# EAGLE schematic Grove - Light Sensor (EAGLE 7.2.0)
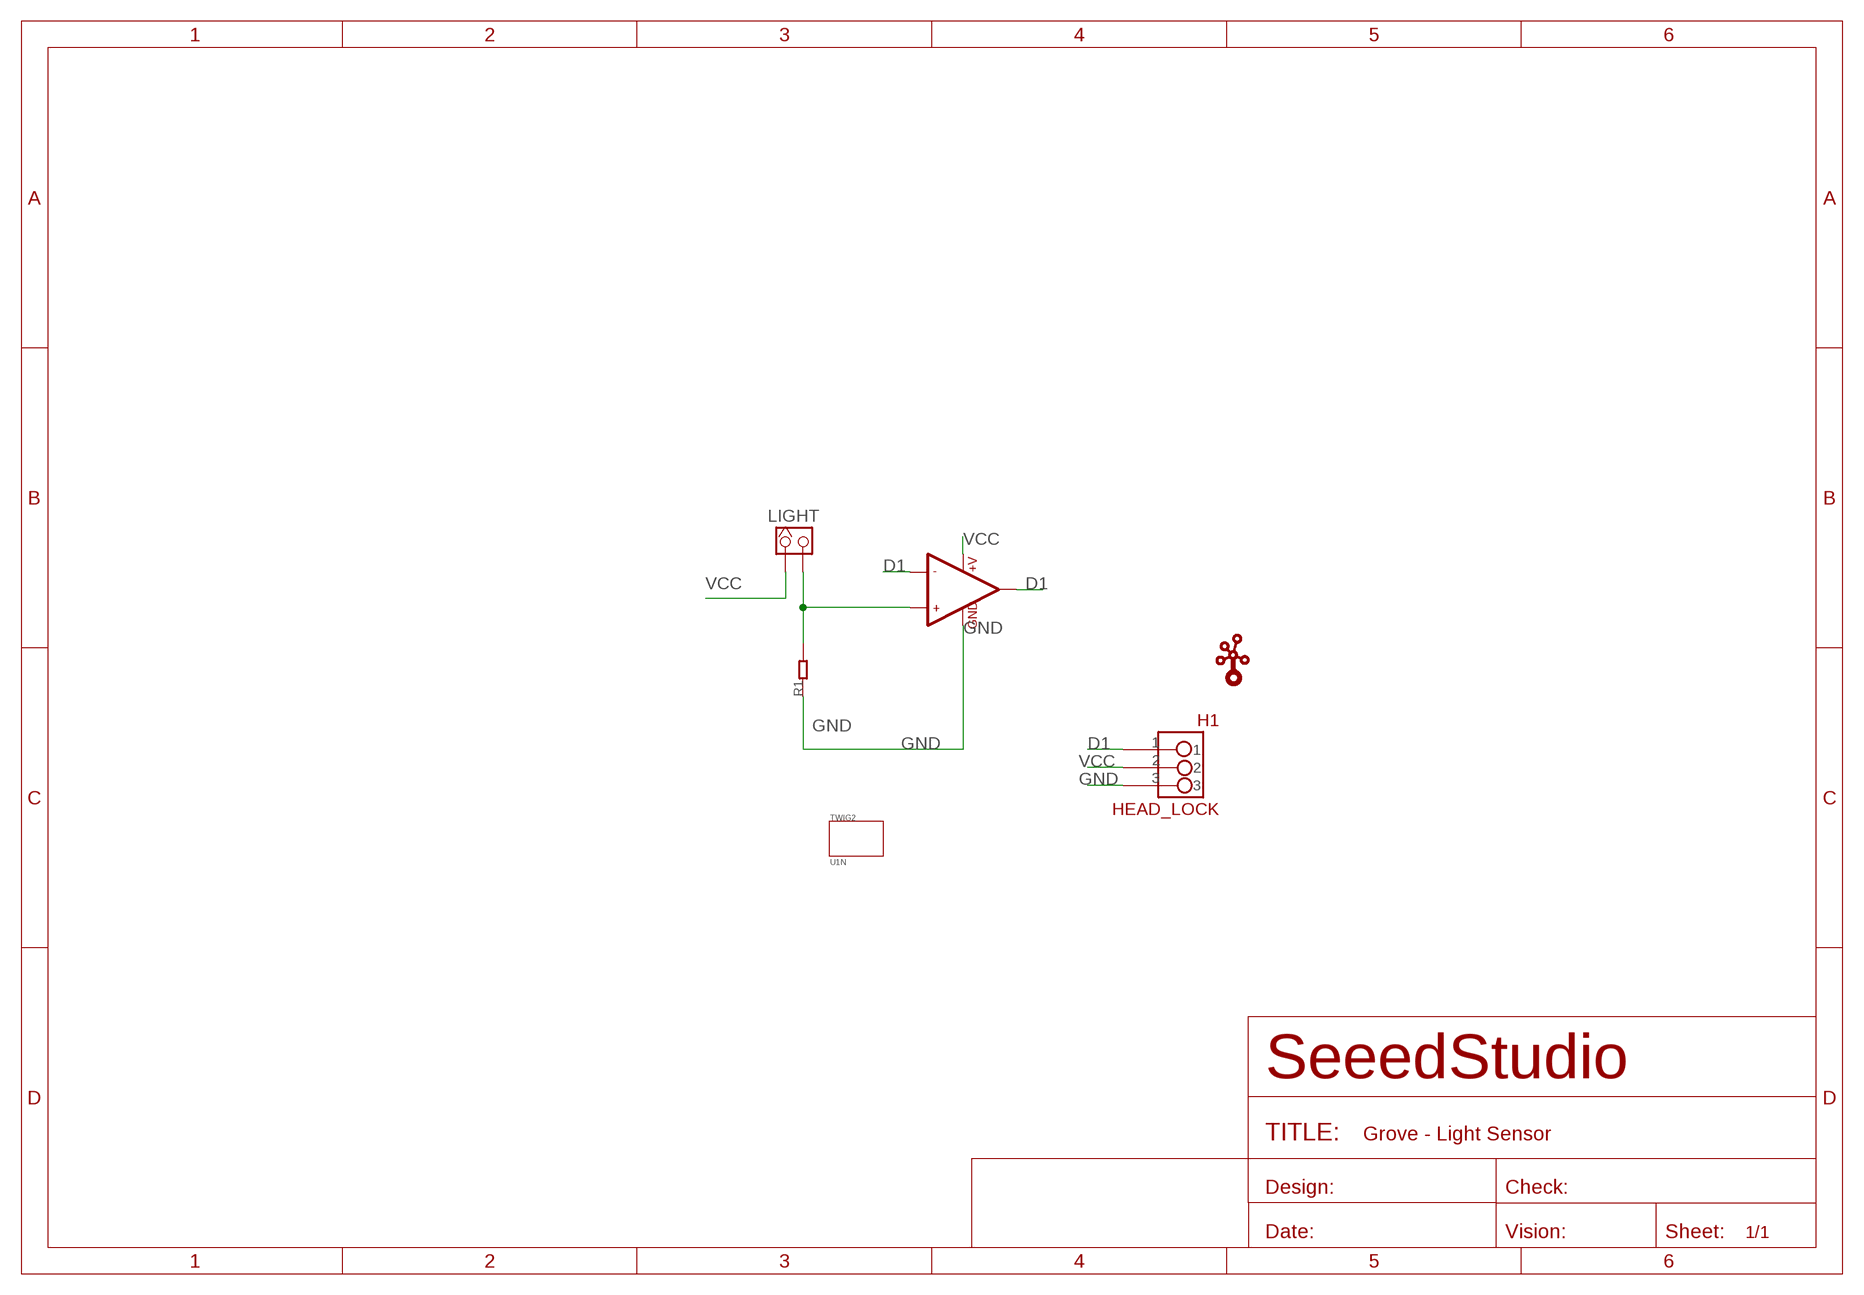
[diagram p0: schematic, sheet 1]

## Parts
H1  HEAD_LOCK  [HEAD_LOCK]
LIGHT  HEADER_1X2_2.54  [CK_1*2]
R1  R0603  [0603]
TWIG2  U1N  [U1N]
U1  LMV358  [SO08]
U$1  TWIGLOGOTWIGLOGO_SMALL  [TWIGLOGO_SMALL]

## Nets
D1: U1.1(OUT1) U1.2(-IN1)
GND: H1.3 R1.1 U1.4(GND)
N$3: LIGHT.2 R1.2 U1.3(+IN1)
VCC: H1.2 LIGHT.1 U1.8(+V)
Unconnected: H1.1 U1.5(+IN2) U1.6(-IN2) U1.7(OUT2)

## Library data of the parts
H1 = HEAD_LOCK:HEAD_LOCK: 带锁的排座
LIGHT = CONNECTER:HEADER_1X2
R1 = CPT_SMD:R0603
TWIG2 = twig_template1:U1N
U1 = ICs_v54:LMV358
U$1 = seeedleo:TWIGLOGO